# Altium schematic sheet BPF_LNA.SchDoc
size A; SheetNumber: 7; SheetTotal: 7
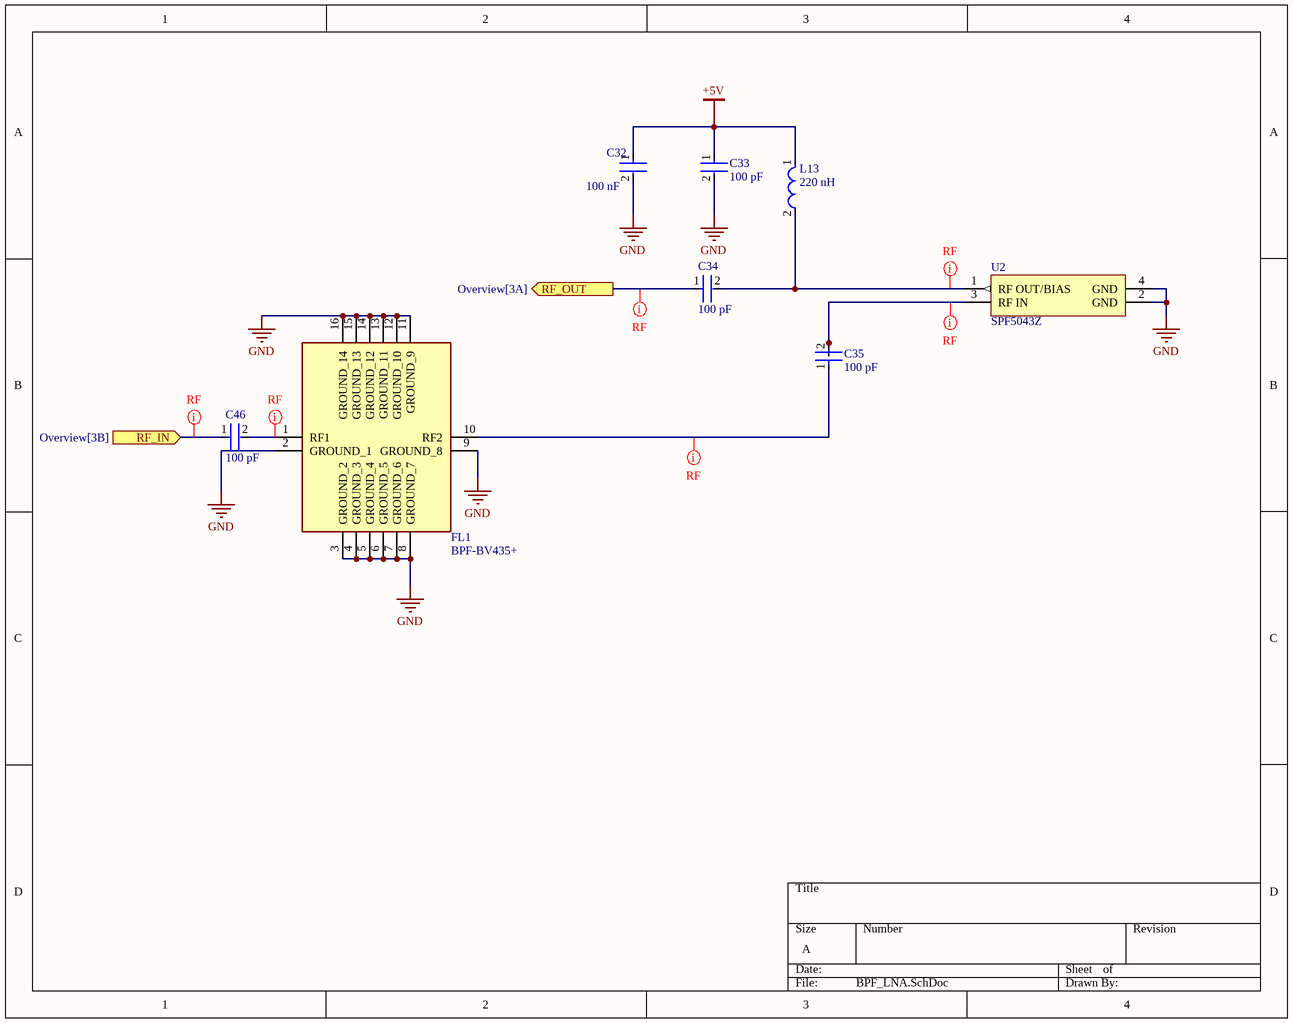
[diagram p0: BPF_LNA.SchDoc]

## Parts
C32  100 nF  [FP-GCM155-0_05-IPC_C]
C33  100 pF  [FP-GQM187-0_15-MFG]
C34  100 pF  [FP-GQM187-0_15-MFG]
C35  100 pF  [FP-GQM187-0_15-MFG]
C46  100 pF  [FP-GQM187-0_15-MFG]
FL1  BPF-BV435+  [BPFBV435]
L13  220 nH  [FP-LQW18AN_80-MFG]
U2  SPF5043Z  [RFMD-SOT343-4_M]

## Ports
RF_IN (in, see Overview[3B]), RF_OUT (out, see Overview[3A])

## Nets
+5V: C32.1 C33.1 L13.1
GND: C32.2 C33.2 FL1.2(GROUND_1) FL1.3(GROUND_2) FL1.4(GROUND_3) FL1.5(GROUND_4) FL1.6(GROUND_5) FL1.7(GROUND_6) FL1.8(GROUND_7) FL1.9(GROUND_8) FL1.11(GROUND_9) FL1.12(GROUND_10) FL1.13(GROUND_11) FL1.14(GROUND_12) FL1.15(GROUND_13) FL1.16(GROUND_14) U2.2(GND) U2.4(GND)
RF_IN: C46.1 ; port RF_IN
RF_OUT: C34.1 ; port RF_OUT
NetC34_2: C34.2 L13.2 U2.1(RF_OUT/BIAS)
NetC35_1: C35.1 FL1.10(RF2)
NetC35_2: C35.2 U2.3(RF_IN)
NetC46_2: C46.2 FL1.1(RF1)

## Layout directives
rule Impedance Constraint [Min = 50.00    Max = 50.00    ]; net class RF: NetC34_2, NetC35_1, NetC35_2, NetC46_2, RF_IN, RF_OUT

## Library data of the parts
C32 = CMP-2008-03711-3: Ceramic Capacitor for Automotive 100nF ±10% 16VDC X7R 0402 Paper T/R Name: GCM155R71C104KA55D; Voltage Rating (DC): 16V; Termination: SMD/SMT; Length: 1mm; Voltage: 16V; Mount: Surface Mount; Packaging: Tape and Reel; Case Code (Metric): 1005; Case/Package: 0402; Voltage Rating: 16V; Min Operating Temperature: -55°C; Case Code (Imperial): 0402; Ratings: AEC-Q200; Height: 0.5mm; Tolerance: 10%; Width: 0.02inch; Radiation Hardening: No; Depth: 0.5mm; Capacitance: 100nF; Max Operating Temperature: 125°C; Package Quantity: 1; REACH SVHC: No SVHC; Thickness: 0.022inch; Dielectric: X7R; Lead Free: Lead Free
C33-C35 C46 = CMP-06035-018516-1: Ceramic Capacitor 100pF ±5% 250VDC C0G 0603 Paper T/R Name: GQM1875C2E101JB12D; Voltage Rating (DC): 250V; Min Operating Temperature: -55°C; Case Code (Metric): 1608; Lead Free: Lead Free; Length: 1.6mm; Voltage Rating: 250V; Termination: SMD/SMT; Packaging: Tape and Reel; Width: 0.031inch; Tolerance: 5%; Thickness: 0.031inch; Capacitance: 100pF; Package Quantity: 4000; Case/Package: 0603; Mount: Surface Mount; Max Operating Temperature: 125°C; Dielectric: C0G; Depth: 0.8mm; Case Code (Imperial): 0603
FL1 = BPF-BV435+: Filter; Manufacturer_Name: Mini-Circuits; Datasheet Link: https://eu.mouser.com/datasheet/3/3705/1/BPF_BV435.pdf; Height: 6.35mm; Manufacturer_Part_Number: BPF-BV435+
L13 = CMP-06042-006715-1: Wire Wound RF Inductor for Automotive 220nH ±5% 280mA 2.08Ω 0603 (1608) Name: LQW18ANR22J8ZD
U2 = CMP-2000-05330-1: AMP, RF, LNA, 50-4000MHZ, SOT343; Manufacturer: RF Micro Devices; Online Catalog: RFMDAmplifiers; RF Type: Cellular,ISM,PCS; Frequency: 50MHz~4GHz; Other Names: 689-1101-6; Current - Supply: 46mA; P1dB: 22.7dB; Gain: 12.9dB; Test Frequency: 1.9GHz; Voltage - Supply: 3V~5V; Noise Figure: 0.8dB; Datasheet URL: http://www.rfmd.com/store/downloads/dl/file/id/27713/spf5043z_data_sheet.pdf; Packaging: Digi-Reel; Package / Case: SC-82A,SOT-343; Family: RFAmplifiers; Series: -; Datasheet Version: Jan-16; Standard Package: 1; Category: RF/IFandRFID; Supplier Device Package: SOT-343; Manufacturer URL: http://www.qorvo.com/